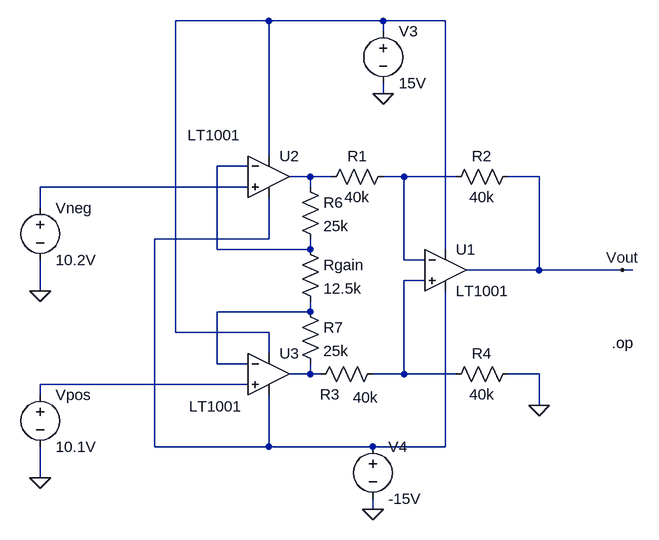
[diagram p0: schematic InstAmp.asc]
InstAmp.asc, the LTspice schematic file:
Version 4
SHEET 1 880 680
WIRE 32 -208 -112 -208
WIRE 208 -208 32 -208
WIRE 304 -208 208 -208
WIRE 208 -192 208 -208
WIRE 208 -96 208 -112
WIRE 32 0 32 -208
WIRE 0 16 -48 16
WIRE 96 32 64 32
WIRE 128 32 96 32
WIRE 240 32 208 32
WIRE 320 32 240 32
WIRE 448 32 400 32
WIRE -208 48 -320 48
WIRE 0 48 -208 48
WIRE 96 48 96 32
WIRE -320 80 -320 48
WIRE 32 128 32 64
WIRE 32 128 -144 128
WIRE -48 144 -48 16
WIRE 96 144 96 128
WIRE 96 144 -48 144
WIRE 304 144 304 -208
WIRE 240 160 240 32
WIRE 272 160 240 160
WIRE 448 176 448 32
WIRE 448 176 336 176
WIRE 480 176 448 176
WIRE 576 176 480 176
WIRE 592 176 576 176
WIRE 272 192 240 192
WIRE -320 208 -320 160
WIRE 96 240 96 224
WIRE 96 240 -48 240
WIRE -112 272 -112 -208
WIRE 32 272 -112 272
WIRE 32 304 32 272
WIRE -48 320 -48 240
WIRE 0 320 -48 320
WIRE 96 336 96 320
WIRE 96 336 64 336
WIRE 112 336 96 336
WIRE 240 336 240 192
WIRE 240 336 192 336
WIRE 320 336 240 336
WIRE 448 336 400 336
WIRE -208 352 -320 352
WIRE 0 352 -208 352
WIRE -320 368 -320 352
WIRE 448 384 448 336
WIRE -144 448 -144 128
WIRE 32 448 32 368
WIRE 32 448 -144 448
WIRE 192 448 32 448
WIRE 304 448 304 208
WIRE 304 448 192 448
WIRE -320 496 -320 448
WIRE 192 544 192 528
FLAG 448 384 0
FLAG -320 208 0
FLAG -320 496 0
FLAG 192 544 0
FLAG 208 -96 0
FLAG 576 176 Vout
DATAFLAG 480 176 ""
DATAFLAG -208 48 ""
DATAFLAG -208 352 ""
DATAFLAG 240 32 ""
DATAFLAG 240 336 ""
SYMBOL Opamps\\LT1001 304 112 R0
SYMATTR InstName U1
SYMBOL Opamps\\LT1001 32 -32 R0
WINDOW 3 -125 0 Left 2
SYMATTR InstName U2
SYMBOL Opamps\\LT1001 32 272 R0
WINDOW 3 -123 114 Left 2
SYMATTR InstName U3
SYMBOL res 112 48 R270
WINDOW 0 32 56 VTop 2
WINDOW 3 0 56 VBottom 2
SYMATTR InstName R1
SYMATTR Value 40k
SYMBOL res 304 48 R270
WINDOW 0 32 56 VTop 2
WINDOW 3 0 56 VBottom 2
SYMATTR InstName R2
SYMATTR Value 40k
SYMBOL res 96 352 R270
WINDOW 0 -31 30 VTop 2
WINDOW 3 -4 85 VBottom 2
SYMATTR InstName R3
SYMATTR Value 40k
SYMBOL res 304 352 R270
WINDOW 0 32 56 VTop 2
WINDOW 3 0 56 VBottom 2
SYMATTR InstName R4
SYMATTR Value 40k
SYMBOL res 80 128 R0
SYMATTR InstName Rgain
SYMATTR Value 12.5k
SYMBOL res 80 32 R0
SYMATTR InstName R6
SYMATTR Value 25k
SYMBOL res 80 224 R0
SYMATTR InstName R7
SYMATTR Value 25k
SYMBOL voltage -320 64 R0
SYMATTR InstName Vneg
SYMATTR Value 10.2V
SYMBOL voltage -320 352 R0
SYMATTR InstName Vpos
SYMATTR Value 10.1V
SYMBOL voltage 208 -208 R0
SYMATTR InstName V3
SYMATTR Value 15V
SYMBOL voltage 192 432 R0
SYMATTR InstName V4
SYMATTR Value -15V
TEXT 560 288 Left 2 !.op

The netlist it stands for:
* InstAmp.asc
XU1 N007 N004 N001 N006 Vout LT1001  ; pins In+ In- V+ V- OUT
XU2 N005 N002 N001 N006 N003 LT1001  ; pins In+ In- V+ V- OUT
XU3 N010 N008 N001 N006 N009 LT1001  ; pins In+ In- V+ V- OUT
R1 N003 N004 40k
R2 N004 Vout 40k
R3 N009 N007 40k
R4 N007 0 40k
Rgain N002 N008 12.5k
R6 N003 N002 25k
R7 N008 N009 25k
Vneg N005 0 10.2V
Vpos N010 0 10.1V
V3 N001 0 15V
V4 N006 0 -15V
.op
.lib LTC.lib
.backanno
.end